# EAGLE design atmega328p (EAGLE 7.2.0)
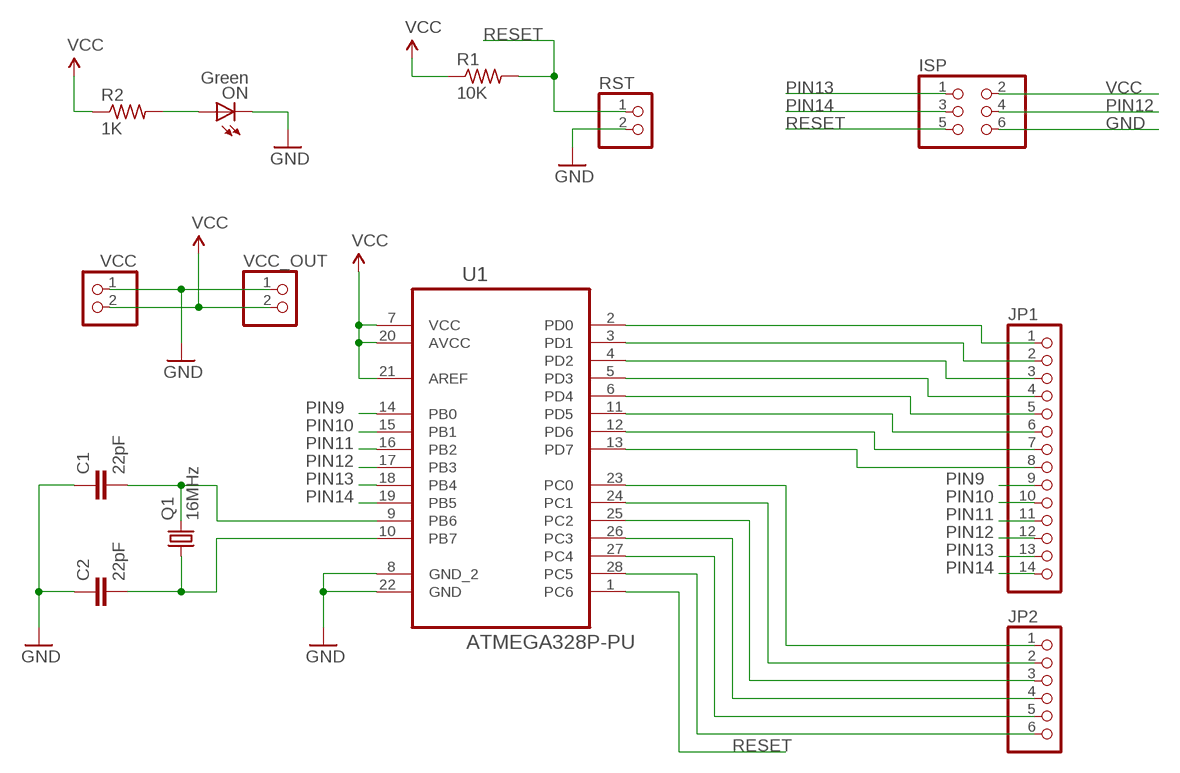
[diagram p0: schematic, sheet 1]

## Parts
C1  22pF  C-EUC0603  [C0603]
C2  22pF  C-EUC0603  [C0603]
ISP  PINHD-2X3  [2X03]
JP1  PINHD-1X14  [1X14]
JP2  PINHD-1X6  [1X06]
ON  Green  LEDCHIPLED_0805  [CHIPLED_0805]
Q1  16MHz  CRYSTALHC49S  [HC49/S]
R1  10K  R-US_R0805  [R0805]
R2  1K  R-US_R0805  [R0805]
RST  PINHD-1X2  [1X02]
U1  ATMEGA328P-PU  [DIP254P762X457-28]
VCC  PINHD-1X2  [1X02]
VCC_OUT  PINHD-1X2  [1X02]

## Nets
GND: C1.1 C2.1 ISP.6 ON.C RST.2 U1.8(GND_2) U1.22(GND) VCC.1 VCC_OUT.1
N$2: C1.2 Q1.2 U1.9(PB6)
N$3: C2.2 Q1.1 U1.10(PB7)
N$4: ON.A R2.2
N$5: JP1.1 U1.2(PD0)
N$6: JP1.2 U1.3(PD1)
N$7: JP1.3 U1.4(PD2)
N$8: JP1.4 U1.5(PD3)
N$9: JP1.5 U1.6(PD4)
N$10: JP1.6 U1.11(PD5)
N$11: JP1.7 U1.12(PD6)
N$12: JP1.8 U1.13(PD7)
N$19: JP2.1 U1.23(PC0)
N$20: JP2.2 U1.24(PC1)
N$21: JP2.3 U1.25(PC2)
N$22: JP2.4 U1.26(PC3)
N$23: JP2.5 U1.27(PC4)
N$24: JP2.6 U1.28(PC5)
PIN9: JP1.9 U1.14(PB0)
PIN10: JP1.10 U1.15(PB1)
PIN11: JP1.11 U1.16(PB2)
PIN12: ISP.4 JP1.12 U1.17(PB3)
PIN13: ISP.1 JP1.13 U1.18(PB4)
PIN14: ISP.3 JP1.14 U1.19(PB5)
RESET: ISP.5 R1.2 RST.1 U1.1(PC6)
VCC: ISP.2 R1.1 R2.1 U1.7(VCC) U1.20(AVCC) U1.21(AREF) VCC.2 VCC_OUT.2

## Library data of the parts
C1 C2 = resistor:C-EU: CAPACITOR, European symbol
ISP = pinhead:PINHD-2X3: PIN HEADER
JP1 = pinhead:PINHD-1X14: PIN HEADER
JP2 = pinhead:PINHD-1X6: PIN HEADER
ON = led:LED: LED OSRAM: - CHIPLED LG R971, LG N971, LY N971, LG Q971, LY Q971, LO R971, LY R971 LH N974, LH R974 LS Q976, LO Q976, LY Q976 LO Q996 - Hyper CHIPLED LW Q18S LB Q993, LB Q99A, LB R99A - SideLED LS A670, LO A670, LY A670, LG A670, LP A670 LB A673, LV A673, LT A673, LW A673 LH A674 LY A675 LS A676, LA A676, LO A676, LY A676, LW A676 LS A679, LY A679, LG A679 - Hyper Micro SIDELED® LS Y876, LA Y876, LO Y876, LY Y876 LT Y87S - SmartLED LW L88C, LW L88S LB L89C, LB L89S, LG L890 LS L89K, LO L89K, LY L89K LS L896, LA L896, LO L896, LY L896 - TOPLED LS T670, LO T670, LY T670, LG T670, LP T670 LSG T670, LSP T670, LSY T670, LOP T670, LYG T670 LG T671, LOG T671, LSG T671 LB T673, LV T673, LT T673, LW T673 LH T674 LS T676, LA T676, LO T676, LY T676, LB T676, LH T676, LSB T676, LW T676 LB T67C, LV T67C, LT T67C, LS T67K, LO T67K, LY T67K, LW E67C LS E67B, LA E67B, LO E67B, LY E67B, LB E67C, LV E67C, LT E67C LW T67C LS T679, LY T679, LG T679 LS T770, LO T770, LY T770, LG T770, LP T770 LB T773, LV T773, LT T773, LW T773 LH T774 LS E675, LA E675, LY E675, LS T675 LS T776, LA T776, LO T776, LY T776, LB T776 LHGB T686 LT T68C, LB T68C - Hyper Mini TOPLED® LB M676 - Mini TOPLED Santana® LG M470 LS M47K, LO M47K, LY M47K Source: http://www.osram.convergy.de LUXEON: - LUMILED® LXK2-PW12-R00, LXK2-PW12-S00, LXK2-PW14-U00, LXK2-PW14-V00 LXK2-PM12-R00, LXK2-PM12-S00, LXK2-PM14-U00 LXK2-PE12-Q00, LXK2-PE12-R00, LXK2-PE12-S00, LXK2-PE14-T00, LXK2-PE14-U00 LXK2-PB12-K00, LXK2-PB12-L00, LXK2-PB12-M00, LXK2-PB14-N00, LXK2-PB14-P00, LXK2-PB14-Q00 LXK2-PR12-L00, LXK2-PR12-M00, LXK2-PR14-Q00, LXK2-PR14-R00 LXK2-PD12-Q00, LXK2-PD12-R00, LXK2-PD12-S00 LXK2-PH12-R00, LXK2-PH12-S00 LXK2-PL12-P00, LXK2-PL12-Q00, LXK2-PL12-R00 Source: www.luxeon.com KINGBRIGHT: KA-3528ASYC Source: www.kingbright.com
Q1 = adafruit:CRYSTAL: CRYSTAL; OC_FARNELL: 1667008; OC_NEWARK: unknown
R1 R2 = resistor:R-US_: RESISTOR, American symbol
RST VCC VCC_OUT = pinhead:PINHD-1X2: PIN HEADER
U1 = Atmel_By_element14_Batch_1-00:ATMEGA328P-PU: 8-bit Microcontroller with In-System Programmable Flash; MPN: ATMEGA328P-PU; OC_FARNELL: 1715487; OC_NEWARK: 15R0268; PACKAGE: PDIP-28; SUPPLIER: Atmel

## Board
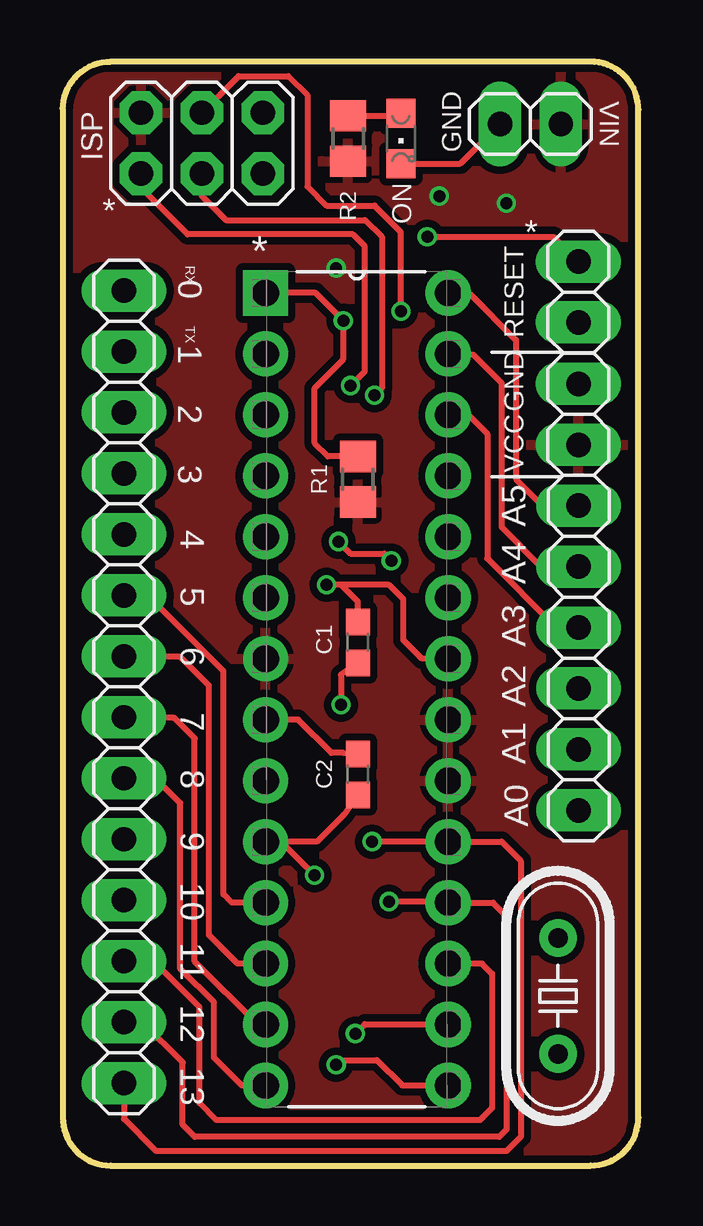
[diagram p1: board, top side]
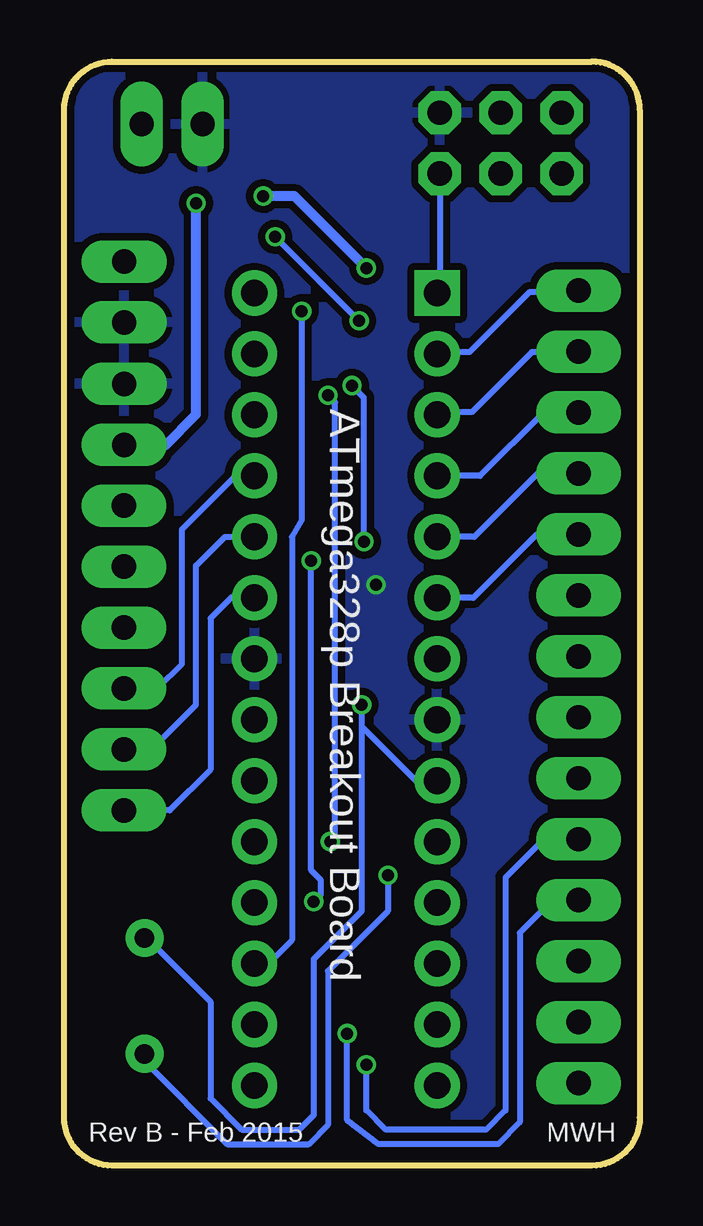
[diagram p2: board, bottom side, seen from below]

Size 24 x 46 mm. Coordinates in mm from the lower left corner, seen from the top.
Outline: 0,44 0,2 arc90 2,0 22,0 arc90 24,2 24,44 arc90 22,46 2,46 arc90 0,44
Copper layers (1*16): Top 0.035mm / dielectric 1.5mm / Bottom 0.035mm
Design rules "dirt_cheap_dirty_boards.v1 *": minimum track width 5mil, minimum drill 12mil, track to track 10mil, track to pad 10mil, pad to pad 10mil, via to via 7mil, smd to smd 0mil, copper to edge 10mil, drill to drill 10mil, minimum pad ring 15mil, minimum via ring 6mil, stop-mask expansion 2mil, vias tented up to drill 25mil, thermal gap 10mil

### Footprints (pad centres in the part's own frame; a part is rotated, then mirrored left to right if it is on the bottom)
C0603 = smd 1.1 x 1: 1 -0.85,0; 2 0.85,0
2X03 = drill 1.016 octagon: 1 -2.54,-1.27; 2 -2.54,1.27; 3 0,-1.27; 4 0,1.27; 5 2.54,-1.27; 6 2.54,1.27
1X14 = drill 1.016 long: 1 -16.51,0; 2 -13.97,0; 3 -11.43,0; 4 -8.89,0; 5 -6.35,0; 6 -3.81,0; 7 -1.27,0; 8 1.27,0; 9 3.81,0; 10 6.35,0; 11 8.89,0; 12 11.43,0; 13 13.97,0; 14 16.51,0
1X06 = drill 1.016 long: 1 -6.35,0; 2 -3.81,0; 3 -1.27,0; 4 1.27,0; 5 3.81,0; 6 6.35,0
CHIPLED_0805 = smd 1.2 x 1.2: A 0,-1.05; C 0,1.05
HC49/S = drill 0.813: 1 -2.413,0; 2 2.413,0
R0805 = smd 1.3 x 1.5: 1 -0.95,0; 2 0.95,0
1X02 = drill 1.016 long: 1 -1.27,0; 2 1.27,0
DIP254P762X457-28 = drill 1.118 square: 1 -7.62,33.02 | drill 1.118: 2 -7.62,30.48; 3 -7.62,27.94; 4 -7.62,25.4; 5 -7.62,22.86; 6 -7.62,20.32; 7 -7.62,17.78; 8 -7.62,15.24; 9 -7.62,12.7; 10 -7.62,10.16; 11 -7.62,7.62; 12 -7.62,5.08; 13 -7.62,2.54; 14 -7.62,0; 15 0,0; 16 0,2.54; 17 0,5.08; 18 0,7.62; 19 0,10.16; 20 0,12.7; 21 0,15.24; 22 0,17.78; 23 0,20.32; 24 0,22.86; 25 0,25.4; 26 0,27.94; 27 0,30.48; 28 0,33.02

### Placement (x,y rotation side)
C1  12.3,21.8 270 top
C2  12.3,16.3 270 top
ISP  5.8,42.6 0 top
JP1  2.55,19.95 270 top
JP2  21.51,21.15 90 top
ON  14.1,42.8 180 top
Q1  20.65,7.07 90 top
R1  12.3,28.6 90 top
R2  11.9,42.8 90 top
RST  21.5,36.4 270 top
U1  16.07,3.34 0 top
VCC  19.5,43.4 0 top
VCC_OUT  21.5,31.3 270 top

### Tracks (layer width: path | path; a pad name or v marks a point on that pad's centre or on a via)
GND  (via drill 0.5)
  Top 0.254: C2.1 11.7,17.2 11.2,17.2 9.82,18.58 U1.8 | ON.C 16.58,41.75 VCC.1 | U1.22 14.98,21.12 14.2,21.9 14.2,23.6 13.6,24.2 11.6,24.2 | 11.6,24.2 v11,24.2 | C1.1 12.3,23.5 11.6,24.2
  pour Bottom (isolate 0.305): 0,46 24,46 24,0 0,0
N$2  (via drill 0.5)
  Top 0.254: C1.2 11.6,20.45 v11.6,19.2
  Bottom 0.254: U1.9 8.49,16 9.3,16 11.6,18.3 | v11.6,19.2 11.6,18.3 | 11.6,18.3 11.6,10.6 13.6,8.6 13.6,2.1 14.2,1.5 16.6,1.5 17.9,2.8 17.9,6.83 20.55,9.48 Q1.2
N$3  (via drill 0.5)
  Top 0.254: C2.2 11.7,14.6 10.6,13.5 U1.10 9.1,13.5 v10.5,12.1
  Bottom 0.254: v10.5,12.1 10.5,10.6 13,8.1 13,1.7 13.8,0.9 17.2,0.9 20.65,4.35 Q1.1
N$4
  Top 0.254: R2.2 13.8,43.75 ON.A
N$5
  Bottom 0.254: JP1.1 3.94,36.46 4,36.4 4.6,36.4 7.1,33.9 8.37,33.9 U1.2
N$6
  Bottom 0.254: JP1.2 3.98,33.92 4,33.9 4.5,33.9 7,31.4 8.33,31.4 U1.3
N$7
  Bottom 0.254: JP1.3 3.98,31.38 4,31.4 6.66,28.74 U1.4
N$8
  Bottom 0.254: JP1.4 2.61,28.9 4.2,28.9 6.9,26.2 U1.5
N$9
  Bottom 0.254: JP1.5 4.3,26.3 6.94,23.66 U1.6
N$10
  Top 0.254: U1.11 7.04,10.96 6.7,11.3 6.7,20.6 3.54,23.76 JP1.6
N$11
  Top 0.254: U1.12 7.28,8.42 6.1,9.6 6.1,20 4.9,21.2 2.57,21.2 JP1.7
N$12
  Top 0.254: JP1.8 4.62,18.68 5.5,17.8 5.5,8.5 8.12,5.88 U1.13
N$19
  Bottom 0.254: U1.23 16.11,23.7 17,23.7 17.9,22.8 17.9,16.5 19.6,14.8 JP2.1
N$20
  Bottom 0.254: JP2.2 21.47,17.3 20.4,17.3 18.5,19.2 18.5,25 17.3,26.2 U1.24
N$21
  Bottom 0.254: U1.25 16.11,28.7 16.9,28.7 19.1,26.5 19.1,20.9 20.12,19.88 JP2.3
N$22
  Top 0.254: U1.26 16.92,31.28 17.7,30.5 17.7,25.3 20.58,22.42 JP2.4
N$23
  Top 0.254: JP2.5 21.47,25 19.9,25 18.3,26.6 18.3,32.6 17.1,33.8 16.09,33.8 U1.27
N$24
  Top 0.254: U1.28 16.13,36.3 17,36.3 18.9,34.4 18.9,28.6 20,27.5 JP2.6
PIN9
  Top 0.254: JP1.9 3.86,16.14 4.9,15.1 4.9,8.2 6.3,6.8 6.3,4.5 7.46,3.34 U1.14
PIN10  (via drill 0.5)
  Top 0.254: U1.15 14.16,3.34 13.1,4.4 11.6,4.4 v11.4,4.2
  Bottom 0.254: JP1.10 4,13.6 5.6,12 5.6,2.3 6.4,1.5 10.6,1.5 11.4,2.3 v11.4,4.2
PIN11  (via drill 0.5)
  Top 0.254: v12.2,5.5 12.6,5.9 15.55,5.9 U1.16
  Bottom 0.254: JP1.11 2.59,11.1 3.6,11.1 5,9.7 5,1.8 5.9,0.9 10.9,0.9 12.2,1.9 v12.2,5.5
PIN12  (via drill 0.5)
  Top 0.254: JP1.12 3.78,8.52 5.7,6.6 5.7,2.6 6.4,1.9 17.4,1.9 17.9,2.4 17.9,8 17.48,8.42 U1.17 | ISP.4 7.33,45.4 9.4,45.4 10.2,44.6 10.2,40.8 11,40 13,40 14.1,38.9 v14.1,35.6
  Bottom 0.254: v14.1,35.6 14.1,26.9 14.5,26.2 14.5,9.4 15.48,8.42 U1.17
PIN13  (via drill 0.5)
  Top 0.254: JP1.13 3.32,5.98 5,4.3 5,1.7 5.5,1.2 18.2,1.2 18.5,1.5 18.5,10.4 17.94,10.96 U1.18 16.03,11 v13.6,11 | ISP.1 3.26,40.74 5.2,38.8 12.1,38.8 12.6,38.3 12.6,33.1 v12,32.5 | v11.5,26 12,25.5 13.4,25.5 v13.7,25.2
  Bottom 0.254: v13.6,11 13.3,11.3 13.3,11.9 13.7,12.3 v13.7,25.2 | v11.5,26 11.5,32 v12,32.5
PIN14  (via drill 0.5)
  Top 0.254: JP1.14 2.55,1.95 3.9,0.6 18.5,0.6 19.1,1.2 19.1,12.7 18.3,13.5 U1.19 v12.9,13.5 | ISP.3 5.8,40.4 6.8,39.4 12.6,39.4 13.3,38.7 13.3,32.4 v13,32.1
  Bottom 0.254: v12.9,13.5 12.7,13.7 12.7,31.8 v13,32.1
RESET  (via drill 0.5)
  Top 0.254: RST.1 20.47,38.7 v15.2,38.7 | R1.2 11.05,29.55 10.5,30.1 10.5,32.4 11.7,33.6 v11.7,35.2 10.54,36.36 U1.1
  Bottom 0.254: v11.7,35.2 v15.2,38.7 | ISP.5 8.34,36.47 U1.1
VCC  (via drill 0.5)
  Bottom 0.254: VCC_OUT.2 21.47,30
  Bottom 0.406: 21.47,30 19.8,30 18.5,31.3 v18.5,40.1 | v11.4,37.4 14.4,40.4 v15.7,40.4
  pour Top (isolate 0.305): 0,46 24,46 24,0 0,0

### Text on the board
tPlace: GND | ISP | VIN | * | RX | * | 0 | RESET | TX | 1 | GND | 2 | VCC | 3 | A5 | 4 | A4 | 5 | A3 | 6 | A2 | 7 | A1 | 8 | A0 | 9 | 10 | 11 | 12 | 13
bPlace: ATmega328p Breakout Board | MWH | Rev B - Feb 2015